# EAGLE design Noise Percussion ctrl (EAGLE 7.7.0)
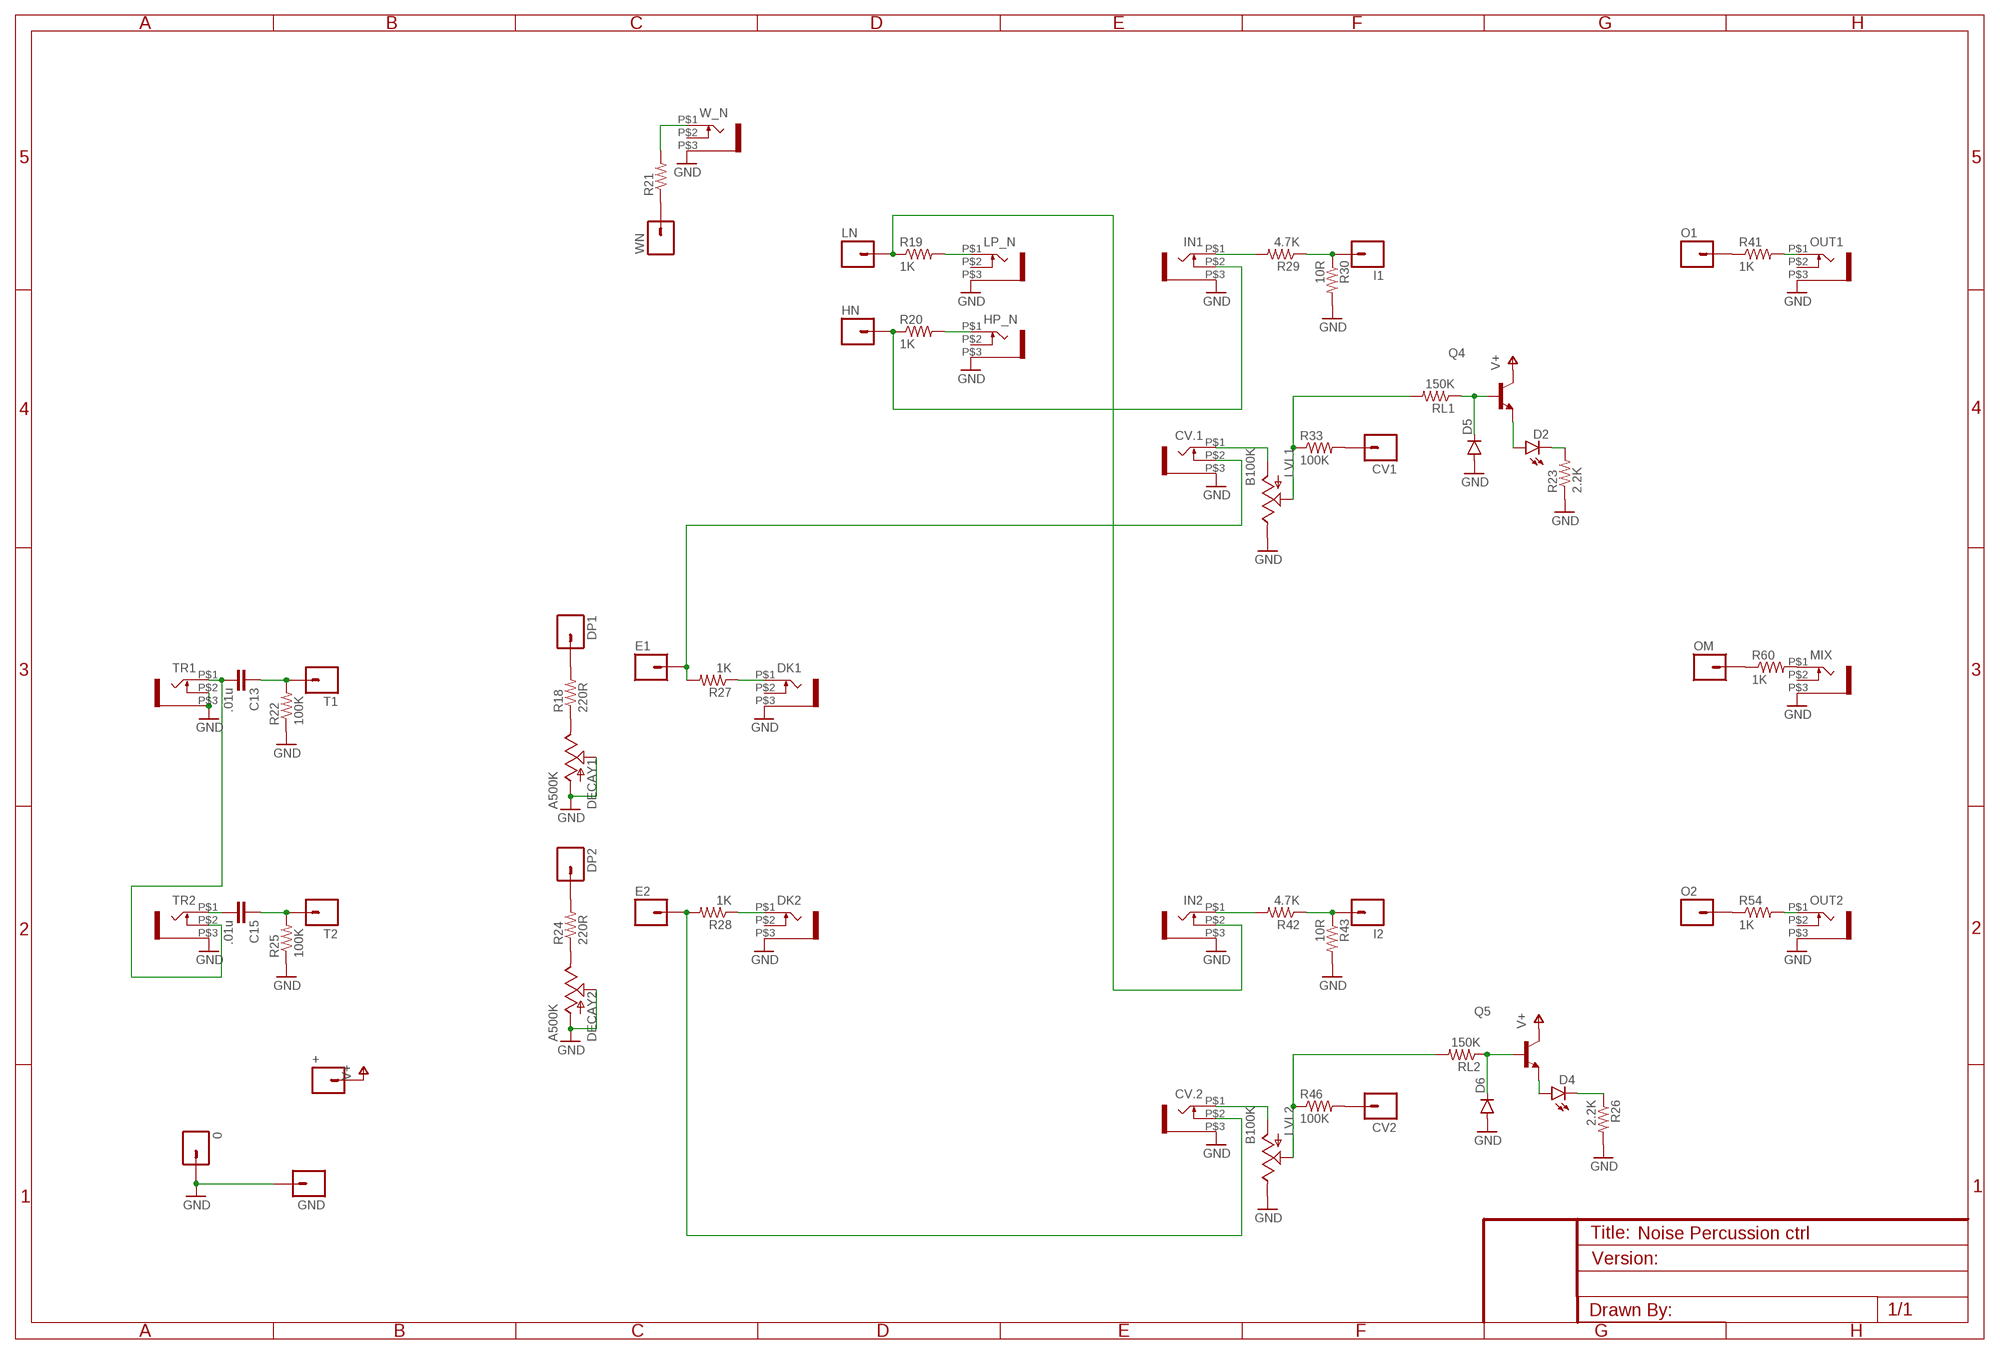
[diagram p0: schematic, sheet 1]

## Parts
0  M01PTH  [1X01]
+  M01PTH  [1X01]
C13  .01u  CAP0805  [0805]
C15  .01u  CAP0805  [0805]
CV1  M01PTH  [1X01]
CV2  M01PTH  [1X01]
CV.1  WQP-PJ301M-12_JACK  [WQP-PJ301M-12_JACK]
CV.2  WQP-PJ301M-12_JACK  [WQP-PJ301M-12_JACK]
D2  LED3MM  [LED3MM]
D4  LED3MM  [LED3MM]
D5  DIODESOD123  [SOD-123]
D6  DIODESOD123  [SOD-123]
DECAY1  A500K  POT  [ALPS_POT]
DECAY2  A500K  POT  [ALPS_POT]
DK1  WQP-PJ301M-12_JACK  [WQP-PJ301M-12_JACK]
DK2  WQP-PJ301M-12_JACK  [WQP-PJ301M-12_JACK]
DP1  M01PTH  [1X01]
DP2  M01PTH  [1X01]
E1  M01PTH  [1X01]
E2  M01PTH  [1X01]
GND  M01PTH  [1X01]
HN  M01PTH  [1X01]
HP_N  WQP-PJ301M-12_JACK  [WQP-PJ301M-12_JACK]
I1  M01PTH  [1X01]
I2  M01PTH  [1X01]
IN1  WQP-PJ301M-12_JACK  [WQP-PJ301M-12_JACK]
IN2  WQP-PJ301M-12_JACK  [WQP-PJ301M-12_JACK]
LN  M01PTH  [1X01]
LP_N  WQP-PJ301M-12_JACK  [WQP-PJ301M-12_JACK]
LVL1  B100K  POT  [ALPS_POT]
LVL2  B100K  POT  [ALPS_POT]
MIX  WQP-PJ301M-12_JACK  [WQP-PJ301M-12_JACK]
O1  M01PTH  [1X01]
O2  M01PTH  [1X01]
OM  M01PTH  [1X01]
OUT1  WQP-PJ301M-12_JACK  [WQP-PJ301M-12_JACK]
OUT2  WQP-PJ301M-12_JACK  [WQP-PJ301M-12_JACK]
Q4  MMBT3904LT1-NPN-SOT23-BEC  [SOT23-BEC]
Q5  MMBT3904LT1-NPN-SOT23-BEC  [SOT23-BEC]
R18  220R  RESISTOR0805-RES  [0805]
R19  1K  RESISTOR0805-RES  [0805]
R20  1K  RESISTOR0805-RES  [0805]
R21  RESISTOR0805-RES  [0805]
R22  100K  RESISTOR0805-RES  [0805]
R23  2.2K  RESISTOR0805-RES  [0805]
R24  220R  RESISTOR0805-RES  [0805]
R25  100K  RESISTOR0805-RES  [0805]
R26  2.2K  RESISTOR0805-RES  [0805]
R27  1K  RESISTOR0805-RES  [0805]
R28  1K  RESISTOR0805-RES  [0805]
R29  4.7K  RESISTOR0805-RES  [0805]
R30  10R  RESISTOR0805-RES  [0805]
R33  100K  RESISTOR0805-RES  [0805]
R41  1K  RESISTOR0805-RES  [0805]
R42  4.7K  RESISTOR0805-RES  [0805]
R43  10R  RESISTOR0805-RES  [0805]
R46  100K  RESISTOR0805-RES  [0805]
R54  1K  RESISTOR0805-RES  [0805]
R60  1K  RESISTOR0805-RES  [0805]
RL1  150K  RESISTOR0805-RES  [0805]
RL2  150K  RESISTOR0805-RES  [0805]
T1  M01PTH  [1X01]
T2  M01PTH  [1X01]
TR1  WQP-PJ301M-12_JACK  [WQP-PJ301M-12_JACK]
TR2  WQP-PJ301M-12_JACK  [WQP-PJ301M-12_JACK]
W_N  WQP-PJ301M-12_JACK  [WQP-PJ301M-12_JACK]
WN  M01PTH  [1X01]

## Nets
GND: 0.1 CV.1.P$3 CV.2.P$3 D5.A D6.A DECAY1.P$2(S) DECAY1.P$3(A) DECAY2.P$2(S) DECAY2.P$3(A) DK1.P$3 DK2.P$3 GND.1 HP_N.P$3 IN1.P$3 IN2.P$3 LP_N.P$3 LVL1.P$1(E) LVL2.P$1(E) MIX.P$3 OUT1.P$3 OUT2.P$3 R22.1 R23.1 R25.1 R26.2 R30.2 R43.2 TR1.P$2 TR1.P$3 TR2.P$3 W_N.P$3
N$1: D6.C Q5.B RL2.1
N$2: HN.1 IN1.P$2 R20.1
N$3: IN1.P$1 R29.2
N$4: I1.1 R29.1 R30.1
N$5: IN2.P$2 LN.1 R19.1
N$6: D5.C Q4.B RL1.1
N$7: R21.1 WN.1
N$8: CV.1.P$2 E1.1 R27.2
N$9: CV.2.P$2 E2.1 R28.2
N$10: DP1.1 R18.2
N$11: DP2.1 R24.2
N$12: O1.1 R41.1
N$13: OM.1 R60.1
N$14: DK2.P$1 R28.1
N$15: O2.1 R54.1
N$16: CV1.1 R33.2
N$17: CV2.1 R46.2
N$18: D2.A Q4.E
N$19: D2.K(C) R23.2
N$20: R21.2 W_N.P$1
N$21: LP_N.P$1 R19.2
N$22: D4.A Q5.E
N$23: D4.K(C) R26.1
N$25: HP_N.P$1 R20.2
N$26: C13.2 TR1.P$1 TR2.P$2
N$27: C13.1 R22.2 T1.1
N$28: DECAY1.P$1(E) R18.1
N$34: C15.2 TR2.P$1
N$35: C15.1 R25.2 T2.1
N$36: DECAY2.P$1(E) R24.1
N$38: DK1.P$1 R27.1
N$42: CV.1.P$1 LVL1.P$3(A)
N$46: LVL1.P$2(S) R33.1 RL1.2
N$51: OUT1.P$1 R41.2
N$52: IN2.P$1 R42.2
N$53: I2.1 R42.1 R43.1
N$60: CV.2.P$1 LVL2.P$3(A)
N$61: LVL2.P$2(S) R46.1 RL2.2
N$66: OUT2.P$1 R54.2
N$79: MIX.P$1 R60.2
V+: +.1 Q4.C Q5.C
Unconnected: DK1.P$2 DK2.P$2 HP_N.P$2 LP_N.P$2 MIX.P$2 OUT1.P$2 OUT2.P$2 W_N.P$2

## Library data of the parts
0 + CV1 CV2 DP1 DP2 E1 E2 GND HN I1 I2 LN O1 O2 OM T1 T2 WN = SparkFun-Connectors:M01: Header 1 Standard 1-pin 0.1" header. Use with straight break away headers (SKU : PRT-00116), right angle break away headers (PRT-00553), swiss pins (PRT-00743), machine pins (PRT-00117), and female headers (PRT-00115).
C13 C15 = SparkFun-Capacitors:CAP: Capacitor Standard 0603 ceramic capacitor, and 0.1" leaded capacitor.
CV.1 CV.2 DK1 DK2 HP_N IN1 IN2 LP_N MIX OUT1 OUT2 TR1 TR2 W_N = thonkiconn:WQP-PJ301M-12_JACK
D2 D4 = SparkFun-LED:LED: LEDs Standard schematic elements and footprints for 5mm, 3mm, 1206, and 0603 sized LEDs. 5mm - Spark Fun Electronics SKU : COM-00529 (and others)
D5 D6 = SparkFun-DiscreteSemi:DIODE: Diode These are standard reverse protection diodes and small signal diodes. SMA package can handle up to about 1A. SOD-323 can handle about 200mA. What the SOD-323 package when ordering, there are some mfgs out there that are 5-pin packages.
DECAY1 DECAY2 LVL1 LVL2 = SparkFun-Electromechanical:POT; PROD_ID: RES-09177
Q4 Q5 = transistor:*-NPN-: NPN Transistror BF959 corrected 2008.03.06
R18-R30 R33 R41-R43 R46 R54 R60 RL1 RL2 = SparkFun-Resistors:RESISTOR: Resistor Basic schematic elements and footprints for 0603, 1206, and PTH resistors.

## Board
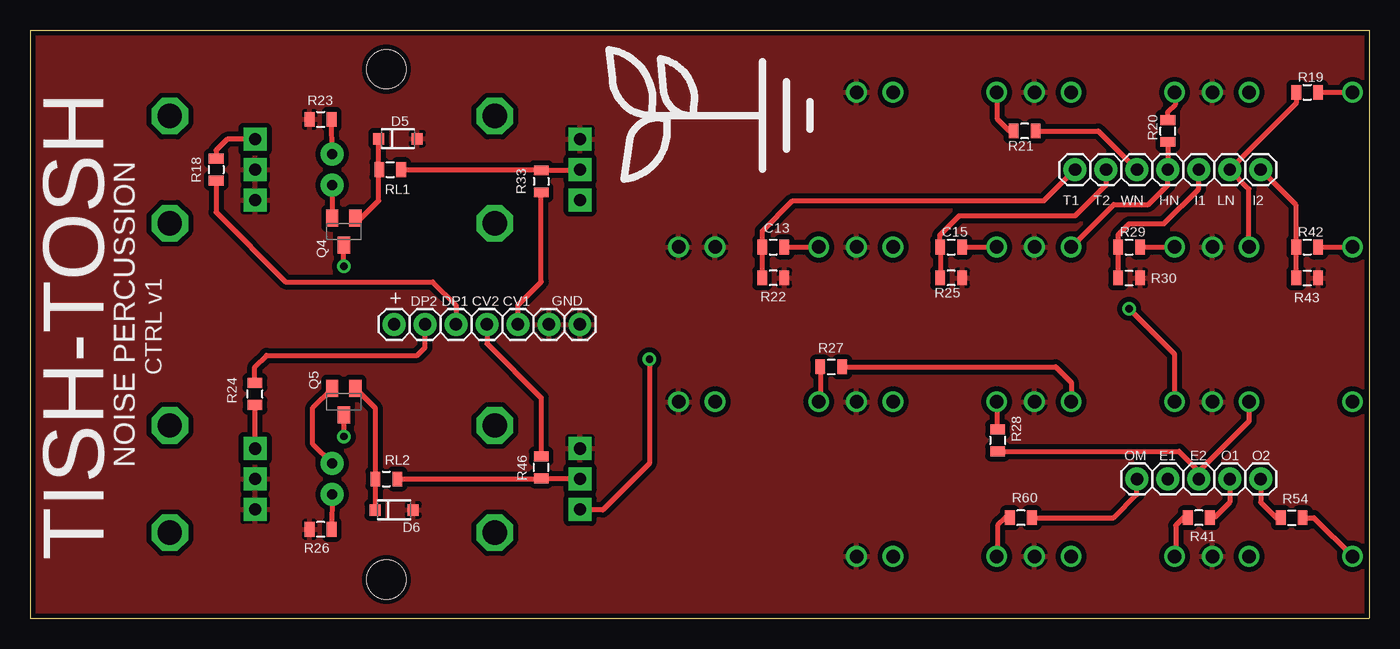
[diagram p1: board, top side]
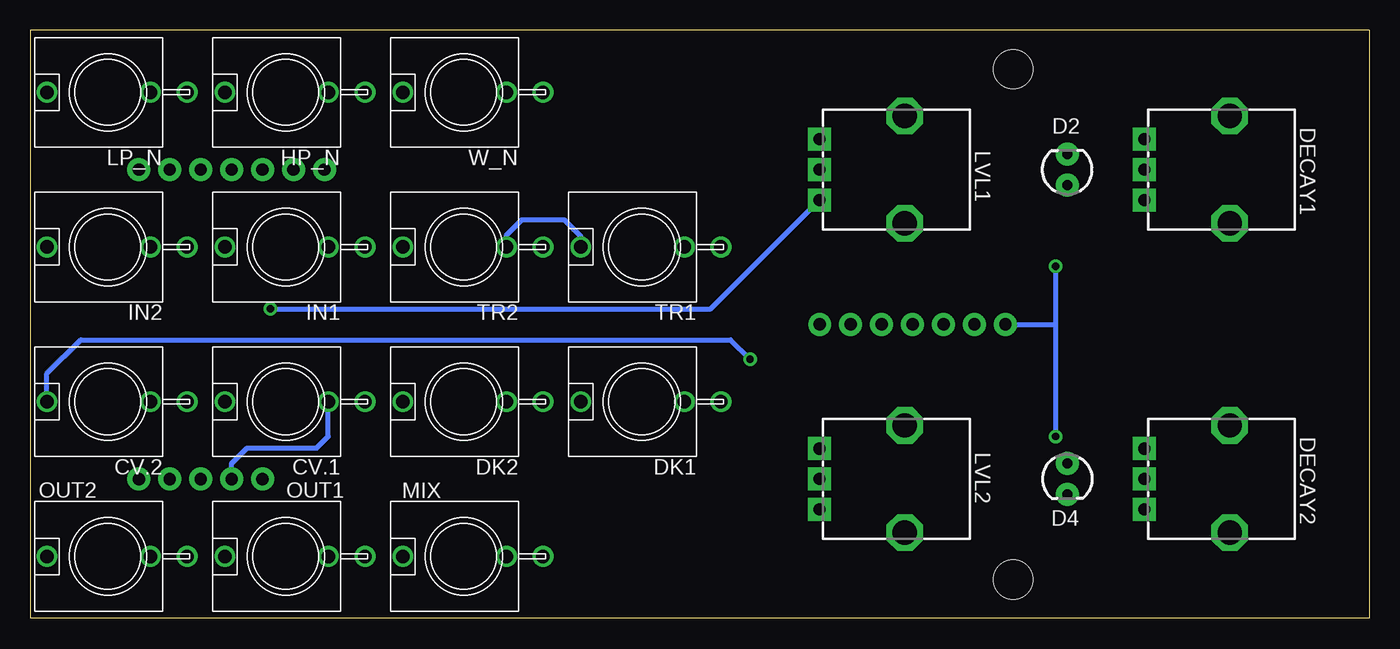
[diagram p2: board, bottom side, seen from below]

Size 109.86 x 48.26 mm. Coordinates in mm from the lower left corner, seen from the top.
Outline: 0,48.26 0,0 109.86,0 109.86,48.26 0,48.26
Copper layers (1*16): Top 0.035mm / dielectric 1.5mm / Bottom 0.035mm
Design rules "SparkFun": minimum track width 8mil, minimum drill 20mil, track to track 8mil, track to pad 8mil, pad to pad 8mil, via to via 8mil, smd to smd 8mil, copper to edge 8mil, drill to drill 8mil, minimum pad ring 12mil, minimum via ring 10mil, stop-mask expansion 4mil, vias tented up to drill 20mil, thermal gap 10mil
Holes 3.2 mm at 29.21,3.17 29.21,45.09

### Footprints (pad centres in the part's own frame; a part is rotated, then mirrored left to right if it is on the bottom)
1X01 = drill 1.016 pad 1.88: 1 0,0
0805 = smd 0.8 x 1.2: 1 -0.9,0; 2 0.9,0
WQP-PJ301M-12_JACK = drill 1.1: P$1 0,5; P$2 0,-3.5; P$3 0,-6.5
LED3MM = drill 0.813 pad 1.88: A -1.27,0; K 1.27,0
SOD-123 = smd 0.9 x 0.95: A 1.575,0; C -1.575,0
ALPS_POT = drill 1 pad 1.88 square: P$1 7,-2.5; P$2 7,0; P$3 7,2.5 | drill 2 octagon: P$4 0,-4.4; P$5 0,4.4
SOT23-BEC = smd 1 x 1.4: B -0.95,-1.1; C 0,1.1; E 0.95,-1.1

### Placement (x,y rotation side)
0  45.09,24.13 0 top
+  29.84,24.13 0 top
C13  60.96,30.48 0 top
C15  75.56,30.48 0 top
CV1  40.01,24.13 0 top
CV2  37.47,24.13 0 top
CV.1  88.9,17.78 90 bottom
CV.2  103.5,17.78 90 bottom
D2  24.77,36.83 90 bottom
D4  24.77,11.43 270 bottom
D5  30.16,39.37 0 top
D6  29.84,8.89 0 top
DECAY1  11.43,36.83 180 bottom
DECAY2  11.43,11.43 180 bottom
DK1  59.69,17.78 90 bottom
DK2  74.3,17.78 90 bottom
DP1  34.92,24.13 0 top
DP2  32.38,24.13 0 top
E1  93.34,11.43 0 top
E2  95.89,11.43 0 top
GND  42.55,24.13 0 top
HN  93.34,36.83 0 top
HP_N  88.9,43.18 90 bottom
I1  95.89,36.83 0 top
I2  100.97,36.83 0 top
IN1  88.9,30.48 90 bottom
IN2  103.5,30.48 90 bottom
LN  98.42,36.83 0 top
LP_N  103.5,43.18 90 bottom
LVL1  38.1,36.83 180 bottom
LVL2  38.1,11.43 180 bottom
MIX  74.3,5.08 90 bottom
O1  98.42,11.43 0 top
O2  100.97,11.43 0 top
OM  90.81,11.43 0 top
OUT1  88.9,5.08 90 bottom
OUT2  103.5,5.08 90 bottom
Q4  25.72,31.75 180 top
Q5  25.72,17.78 180 top
R18  15.24,36.83 270 top
R19  104.78,43.18 0 top
R20  93.34,40.01 90 top
R21  81.6,40.01 180 top
R22  60.96,27.94 180 top
R23  23.81,40.96 0 top
R24  18.41,18.41 90 top
R25  75.56,27.94 180 top
R26  23.81,7.3 180 top
R27  65.72,20.64 0 top
R28  79.38,14.61 270 top
R29  90.17,30.48 0 top
R30  90.17,27.94 0 top
R33  41.91,35.88 270 top
R41  95.89,8.26 180 top
R42  104.78,30.48 0 top
R43  104.78,27.94 0 top
R46  41.91,12.38 90 top
R54  103.5,8.26 0 top
R60  81.28,8.26 180 top
RL1  29.53,36.83 0 top
RL2  29.21,11.43 0 top
T1  85.72,36.83 0 top
T2  88.27,36.83 0 top
TR1  59.69,30.48 90 bottom
TR2  74.3,30.48 90 bottom
U$1  [LOGO_LARGE]  60.01,41.27 90 top
W_N  74.3,43.18 90 bottom
WN  90.81,36.83 0 top

### Tracks (layer width: path | path; a pad name or v marks a point on that pad's centre or on a via)
GND
  pour Top (isolate 0.406): 0,0 0,48.26 109.86,48.26 109.86,0
N$1
  Top 0.406: D6.C 28.31,8.89 RL2.1 28.31,17.24 Q5.B
N$2
  Top 0.406: IN1.P$2 88.9,33.97 91.76,33.97 93.34,35.56 HN.1 R20.1
N$3
  Top 0.406: R29.2 IN1.P$1
N$4
  Top 0.406: R30.1 R29.1 89.27,31.48 90.17,32.38 93.03,32.38 95.89,35.24 I1.1
N$5
  Top 0.406: R19.1 103.88,42.28 LN.1 100,35.25 IN2.P$2
N$6
  Top 0.406: Q4.B 27.15,32.85 27.15,32.86 28.57,34.29 28.57,36.78 RL1.1 28.59,36.79 D5.C
N$7
  Top 0.406: R21.1 87.63,40.01 WN.1
N$8
  Top 0.406: R27.2 84.14,20.64 85.41,19.37 CV.1.P$2
  Bottom 0.406: E1.1 93.34,12.7 92.08,13.97 86.36,13.97 85.41,14.92 CV.1.P$2
N$9
  Top 0.406: E2.1 95.89,12.06 | 95.89,12.06 100.01,16.19 100.01,17.77 CV.2.P$2 | R28.2 94.25,13.71 95.89,12.06
N$10
  Top 0.406: R18.2 15.24,33.34 20.95,27.62 33.02,27.62 34.92,25.72 DP1.1
N$11
  Top 0.406: R24.2 18.41,20.64 19.37,21.59 31.75,21.59 32.38,22.23 DP2.1
N$12
  Top 0.406: O1.1 98.42,9.53 97.16,8.26 R41.1
N$13
  Top 0.406: R60.1 88.9,8.26 90.81,10.16 OM.1
N$14
  Top 0.406: R28.1 79.38,17.7 DK2.P$1
N$15
  Top 0.406: O2.1 100.97,9.53 102.23,8.26 R54.1
N$16
  Top 0.406: CV1.1 40.01,25.72 41.91,27.62 R33.2
N$17
  Top 0.406: CV2.1 37.47,22.54 41.91,18.1 R46.2
N$18
  Top 0.406: D2.A Q4.E
N$19
  Top 0.406: D2.K R23.2
N$20
  Top 0.406: R21.2 80.33,40.01 79.38,40.96 79.38,43.1 W_N.P$1
N$21
  Top 0.406: R19.2 LP_N.P$1
N$22
  Top 0.406: D4.A 23.18,14.29 23.18,17.29 Q5.E
N$23
  Top 0.406: D4.K R26.1
N$25
  Top 0.406: R20.2 93.34,41.59 93.98,42.23 93.98,43.1 HP_N.P$1
N$26
  Top 0.406: C13.2 TR1.P$1
  Bottom 0.406: TR1.P$1 64.69,31.35 66.04,32.7 69.53,32.7 70.8,31.43 TR2.P$2
N$27
  Top 0.406: R22.2 C13.1 60.06,31.8 62.55,34.29 83.19,34.29 T1.1
N$28
  Top 0.406: DECAY1.P$1 16.15,39.33 15.24,38.42 R18.1
N$34
  Top 0.406: C15.2 TR2.P$1
N$35
  Top 0.406: T2.1 88.27,35.56 85.72,33.02 76.2,33.02 74.61,31.43 74.61,30.53 C15.1 R25.2
N$36
  Top 0.406: DECAY2.P$1 18.43,17.5 R24.1
N$38
  Top 0.406: R27.1 64.82,17.91 DK1.P$1
N$42  (via drill 0.6)
  Top 0.406: CV.1.P$1 93.9,21.67 v90.17,25.4
  Bottom 0.406: v90.17,25.4 54.03,25.4 LVL1.P$3
N$46
  Top 0.406: LVL1.P$2 45.05,36.78 R33.1 41.86,36.83 RL1.2
N$51
  Top 0.406: R41.2 94.61,8.26 93.98,7.62 93.98,5.16 OUT1.P$1
N$52
  Top 0.406: R42.2 IN2.P$1
N$53
  Top 0.406: R43.1 R42.1 103.88,33.92 I2.1
N$60  (via drill 0.6)
  Top 0.406: v50.8,21.27 50.8,12.7 46.99,8.89 45.14,8.89 LVL2.P$3
  Bottom 0.406: CV.2.P$1 108.5,20.08 105.73,22.86 52.39,22.86 v50.8,21.27
N$61
  Top 0.406: LVL2.P$2 45.05,11.48 R46.1 41.86,11.43 RL2.2
N$66
  Top 0.406: R54.2 105.33,8.26 OUT2.P$1
N$79
  Top 0.406: R60.2 80.01,8.26 79.38,7.62 79.38,5.16 MIX.P$1
V+  (via drill 0.6)
  Top 0.406: v25.72,28.89 Q4.C | Q5.C v25.72,14.92
  Bottom 0.406: +.1 25.72,24.13 | 25.72,24.13 v25.72,28.89 | v25.72,14.92 25.72,24.13

### Text on the board
tPlace: CTRL v1 | NOISE PERCUSSION | TISH-TOSH